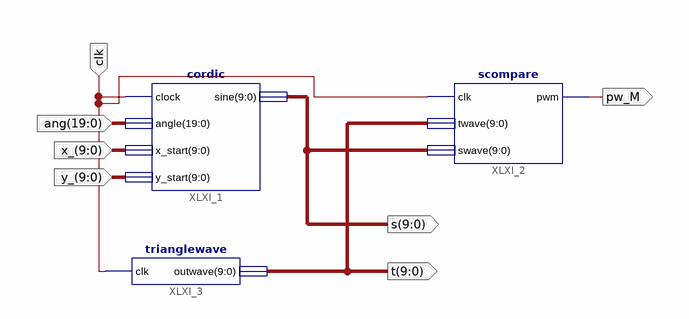
[diagram p0: schematic sheet 1]
// Xilinx ISE schematic test.sch (spartan6) as structural Verilog: 3 symbols, 7 ports
module test (
  input  clk,
  input  [9:0] x_,
  input  [9:0] y_,
  input  [19:0] ang,
  output pw_M,
  output [9:0] s,
  output [9:0] t
);

  cordic XLXI_1 (.clock(clk), .angle(ang), .x_start(x_), .y_start(y_), .sine(s));
  scompare XLXI_2 (.clk(clk), .twave(t), .swave(s), .pwm(pw_M));
  trianglewave XLXI_3 (.clk(clk), .outwave(t));
endmodule
